# EAGLE design Main (EAGLE 9.6.2)
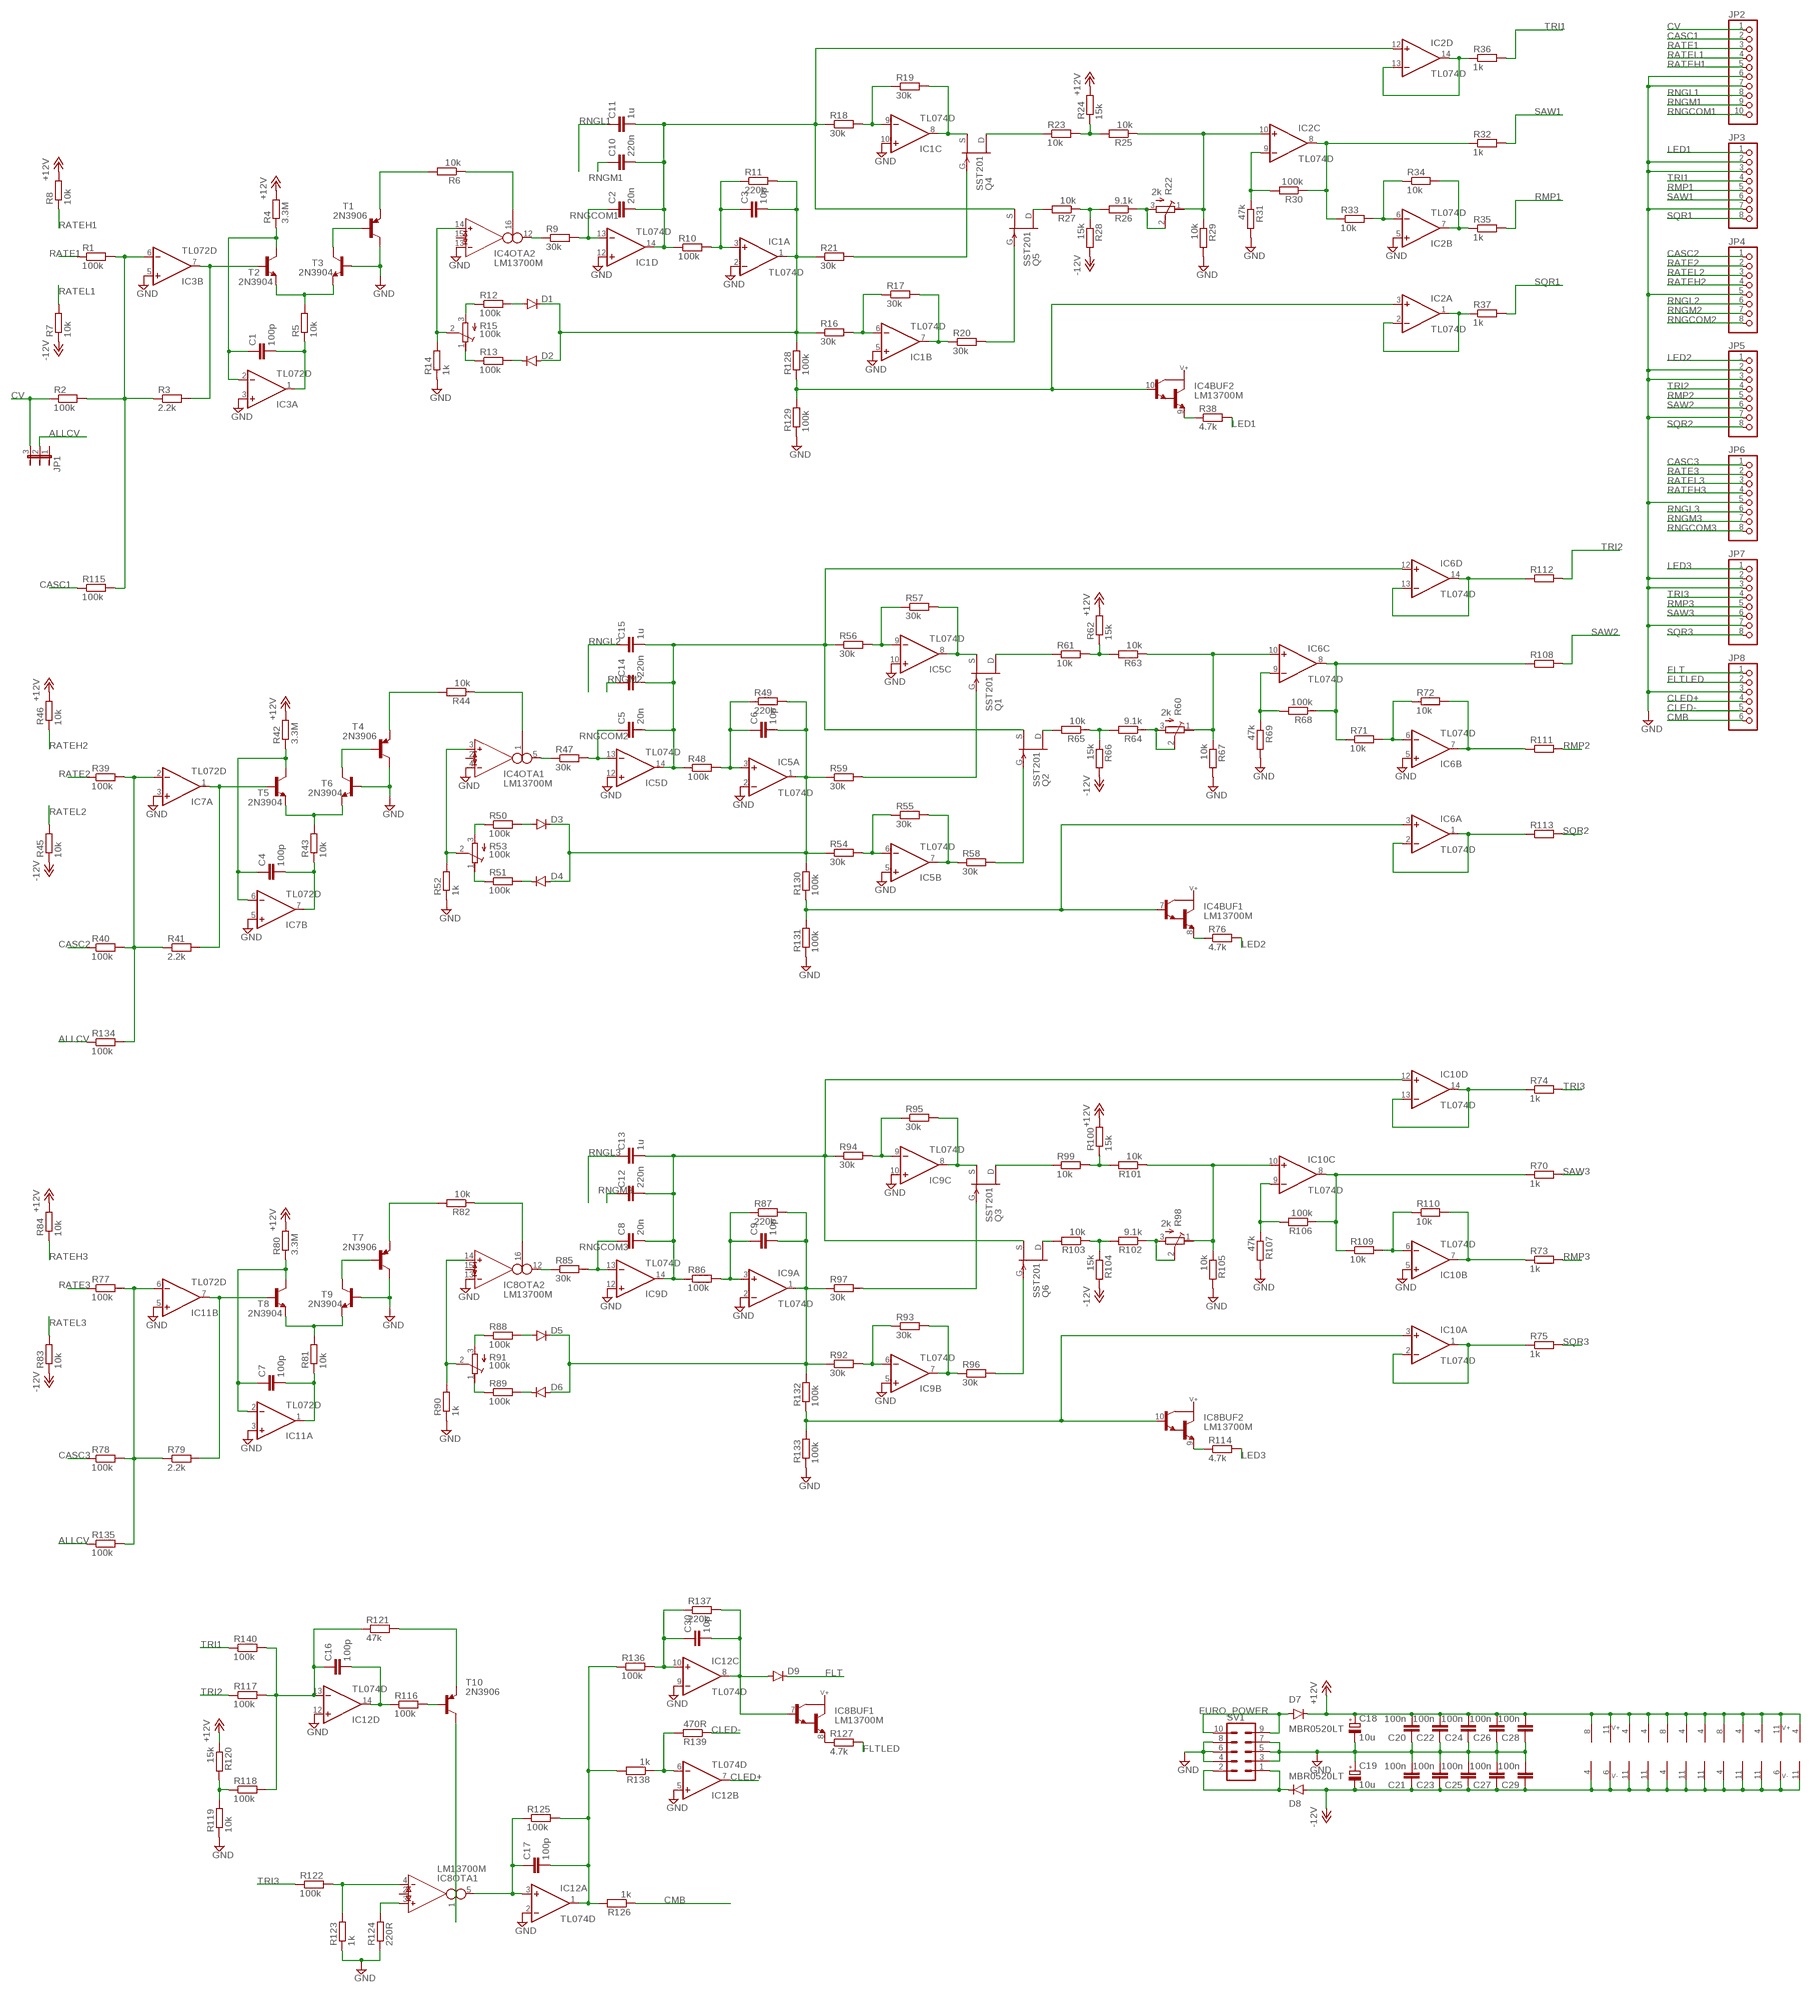
[diagram p0: schematic, sheet 1]

## Parts
C1  100p  C-EUC0805  [C0805]
C2  20n  C-EU050-025X075  [C050-025X075]
C3  10p  C-EUC0805  [C0805]
C4  100p  C-EUC0805  [C0805]
C5  20n  C-EU050-025X075  [C050-025X075]
C6  10p  C-EUC0805  [C0805]
C7  100p  C-EUC0805  [C0805]
C8  20n  C-EU050-025X075  [C050-025X075]
C9  10p  C-EUC0805  [C0805]
C10  220n  C-EU050-035X075  [C050-035X075]
C11  1u  C-EU050-045X075  [C050-045X075]
C12  220n  C-EU050-035X075  [C050-035X075]
C13  1u  C-EU050-045X075  [C050-045X075]
C14  220n  C-EU050-035X075  [C050-035X075]
C15  1u  C-EU050-045X075  [C050-045X075]
C16  100p  C-EUC0805  [C0805]
C17  100p  C-EUC0805  [C0805]
C18  10u  CPOL-EUE2.5-5  [E2,5-5]
C19  10u  CPOL-EUE2.5-5  [E2,5-5]
C20  100n  C-EUC0805  [C0805]
C21  100n  C-EUC0805  [C0805]
C22  100n  C-EUC0805  [C0805]
C23  100n  C-EUC0805  [C0805]
C24  100n  C-EUC0805  [C0805]
C25  100n  C-EUC0805  [C0805]
C26  100n  C-EUC0805  [C0805]
C27  100n  C-EUC0805  [C0805]
C28  100n  C-EUC0805  [C0805]
C29  100n  C-EUC0805  [C0805]
C30  10p  C-EUC0805  [C0805]
D1  DIODE-SOD123  [SOD123]
D2  DIODE-SOD123  [SOD123]
D3  DIODE-SOD123  [SOD123]
D4  DIODE-SOD123  [SOD123]
D5  DIODE-SOD123  [SOD123]
D6  DIODE-SOD123  [SOD123]
D7  MBR0520LT  [SOD123]
D8  MBR0520LT  [SOD123]
D9  DIODE-SOD123  [SOD123]
IC1  TL074D  [SO14]
IC2  TL074D  [SO14]
IC3  TL072D  [SO08]
IC4  LM13700M  [SO16]
IC5  TL074D  [SO14]
IC6  TL074D  [SO14]
IC7  TL072D  [SO08]
IC8  LM13700M  [SO16]
IC9  TL074D  [SO14]
IC10  TL074D  [SO14]
IC11  TL072D  [SO08]
IC12  TL074D  [SO14]
JP1  JP2E  [JP2]
JP2  PINHD-1X10  [1X10]
JP3  PINHD-1X8  [1X08]
JP4  PINHD-1X8  [1X08]
JP5  PINHD-1X8  [1X08]
JP6  PINHD-1X8  [1X08]
JP7  PINHD-1X8  [1X08]
JP8  PINHD-1X6  [1X06]
Q1  SST201  [SOT23]
Q2  SST201  [SOT23]
Q3  SST201  [SOT23]
Q4  SST201  [SOT23]
Q5  SST201  [SOT23]
Q6  SST201  [SOT23]
R1  100k  R-EU_R0805  [R0805]
R2  100k  R-EU_R0805  [R0805]
R3  2.2k  R-EU_R0805  [R0805]
R4  3.3M  R-EU_R0805  [R0805]
R5  10k  R-EU_R0805  [R0805]
R6  10k  R-EU_R0805  [R0805]
R7  10k  R-EU_R0805  [R0805]
R8  10k  R-EU_R0805  [R0805]
R9  30k  R-EU_R0805  [R0805]
R10  100k  R-EU_R0805  [R0805]
R11  220k  R-EU_R0805  [R0805]
R12  100k  R-EU_R0805  [R0805]
R13  100k  R-EU_R0805  [R0805]
R14  1k  R-EU_R0805  [R0805]
R15  100k  R-TRIMMT93XB  [RTRIMT93XB]
R16  30k  R-EU_R0805  [R0805]
R17  30k  R-EU_R0805  [R0805]
R18  30k  R-EU_R0805  [R0805]
R19  30k  R-EU_R0805  [R0805]
R20  30k  R-EU_R0805  [R0805]
R21  30k  R-EU_R0805  [R0805]
R22  2k  R-TRIMMT93XB  [RTRIMT93XB]
R23  10k  R-EU_R0805  [R0805]
R24  15k  R-EU_R0805  [R0805]
R25  10k  R-EU_R0805  [R0805]
R26  9.1k  R-EU_R0805  [R0805]
R27  10k  R-EU_R0805  [R0805]
R28  15k  R-EU_R0805  [R0805]
R29  10k  R-EU_R0805  [R0805]
R30  100k  R-EU_R0805  [R0805]
R31  47k  R-EU_R0805  [R0805]
R32  1k  R-EU_R0805  [R0805]
R33  10k  R-EU_R0805  [R0805]
R34  10k  R-EU_R0805  [R0805]
R35  1k  R-EU_R0805  [R0805]
R36  1k  R-EU_R0805  [R0805]
R37  1k  R-EU_R0805  [R0805]
R38  4.7k  R-EU_R0805  [R0805]
R39  100k  R-EU_R0805  [R0805]
R40  100k  R-EU_R0805  [R0805]
R41  2.2k  R-EU_R0805  [R0805]
R42  3.3M  R-EU_R0805  [R0805]
R43  10k  R-EU_R0805  [R0805]
R44  10k  R-EU_R0805  [R0805]
R45  10k  R-EU_R0805  [R0805]
R46  10k  R-EU_R0805  [R0805]
R47  30k  R-EU_R0805  [R0805]
R48  100k  R-EU_R0805  [R0805]
R49  220k  R-EU_R0805  [R0805]
R50  100k  R-EU_R0805  [R0805]
R51  100k  R-EU_R0805  [R0805]
R52  1k  R-EU_R0805  [R0805]
R53  100k  R-TRIMMT93XB  [RTRIMT93XB]
R54  30k  R-EU_R0805  [R0805]
R55  30k  R-EU_R0805  [R0805]
R56  30k  R-EU_R0805  [R0805]
R57  30k  R-EU_R0805  [R0805]
R58  30k  R-EU_R0805  [R0805]
R59  30k  R-EU_R0805  [R0805]
R60  2k  R-TRIMMT93XB  [RTRIMT93XB]
R61  10k  R-EU_R0805  [R0805]
R62  15k  R-EU_R0805  [R0805]
R63  10k  R-EU_R0805  [R0805]
R64  9.1k  R-EU_R0805  [R0805]
R65  10k  R-EU_R0805  [R0805]
R66  15k  R-EU_R0805  [R0805]
R67  10k  R-EU_R0805  [R0805]
R68  100k  R-EU_R0805  [R0805]
R69  47k  R-EU_R0805  [R0805]
R70  1k  R-EU_R0805  [R0805]
R71  10k  R-EU_R0805  [R0805]
R72  10k  R-EU_R0805  [R0805]
R73  1k  R-EU_R0805  [R0805]
R74  1k  R-EU_R0805  [R0805]
R75  1k  R-EU_R0805  [R0805]
R76  4.7k  R-EU_R0805  [R0805]
R77  100k  R-EU_R0805  [R0805]
R78  100k  R-EU_R0805  [R0805]
R79  2.2k  R-EU_R0805  [R0805]
R80  3.3M  R-EU_R0805  [R0805]
R81  10k  R-EU_R0805  [R0805]
R82  10k  R-EU_R0805  [R0805]
R83  10k  R-EU_R0805  [R0805]
R84  10k  R-EU_R0805  [R0805]
R85  30k  R-EU_R0805  [R0805]
R86  100k  R-EU_R0805  [R0805]
R87  220k  R-EU_R0805  [R0805]
R88  100k  R-EU_R0805  [R0805]
R89  100k  R-EU_R0805  [R0805]
R90  1k  R-EU_R0805  [R0805]
R91  100k  R-TRIMMT93XB  [RTRIMT93XB]
R92  30k  R-EU_R0805  [R0805]
R93  30k  R-EU_R0805  [R0805]
R94  30k  R-EU_R0805  [R0805]
R95  30k  R-EU_R0805  [R0805]
R96  30k  R-EU_R0805  [R0805]
R97  30k  R-EU_R0805  [R0805]
R98  2k  R-TRIMMT93XB  [RTRIMT93XB]
R99  10k  R-EU_R0805  [R0805]
R100  15k  R-EU_R0805  [R0805]
R101  10k  R-EU_R0805  [R0805]
R102  9.1k  R-EU_R0805  [R0805]
R103  10k  R-EU_R0805  [R0805]
R104  15k  R-EU_R0805  [R0805]
R105  10k  R-EU_R0805  [R0805]
R106  100k  R-EU_R0805  [R0805]
R107  47k  R-EU_R0805  [R0805]
R108  R-EU_R0805  [R0805]
R109  10k  R-EU_R0805  [R0805]
R110  10k  R-EU_R0805  [R0805]
R111  R-EU_R0805  [R0805]
R112  R-EU_R0805  [R0805]
R113  R-EU_R0805  [R0805]
R114  4.7k  R-EU_R0805  [R0805]
R115  100k  R-EU_R0805  [R0805]
R116  100k  R-EU_R0805  [R0805]
R117  100k  R-EU_R0805  [R0805]
R118  100k  R-EU_R0805  [R0805]
R119  10k  R-EU_R0805  [R0805]
R120  15k  R-EU_R0805  [R0805]
R121  47k  R-EU_R0805  [R0805]
R122  100k  R-EU_R0805  [R0805]
R123  1k  R-EU_R0805  [R0805]
R124  220R  R-EU_R0805  [R0805]
R125  100k  R-EU_R0805  [R0805]
R126  1k  R-EU_R0805  [R0805]
R127  4.7k  R-EU_R0805  [R0805]
R128  100k  R-EU_R0805  [R0805]
R129  100k  R-EU_R0805  [R0805]
R130  100k  R-EU_R0805  [R0805]
R131  100k  R-EU_R0805  [R0805]
R132  100k  R-EU_R0805  [R0805]
R133  100k  R-EU_R0805  [R0805]
R134  100k  R-EU_R0805  [R0805]
R135  100k  R-EU_R0805  [R0805]
R136  100k  R-EU_R0805  [R0805]
R137  220k  R-EU_R0805  [R0805]
R138  1k  R-EU_R0805  [R0805]
R139  470R  R-EU_R0805  [R0805]
R140  100k  R-EU_R0805  [R0805]
SV1  EURO_POWER  EURO_POWER_HEADERFAT_PADS  [EURO_PWR_HEADER_FAT]
T1  2N3906  MMBT3906LT1-PNP-SOT23-BEC  [SOT23-BEC]
T2  2N3904  MMBT3904LT1-NPN-SOT23-BEC  [SOT23-BEC]
T3  2N3904  MMBT3904LT1-NPN-SOT23-BEC  [SOT23-BEC]
T4  2N3906  MMBT3906LT1-PNP-SOT23-BEC  [SOT23-BEC]
T5  2N3904  MMBT3904LT1-NPN-SOT23-BEC  [SOT23-BEC]
T6  2N3904  MMBT3904LT1-NPN-SOT23-BEC  [SOT23-BEC]
T7  2N3906  MMBT3906LT1-PNP-SOT23-BEC  [SOT23-BEC]
T8  2N3904  MMBT3904LT1-NPN-SOT23-BEC  [SOT23-BEC]
T9  2N3904  MMBT3904LT1-NPN-SOT23-BEC  [SOT23-BEC]
T10  2N3906  MMBT3906LT1-PNP-SOT23-BEC  [SOT23-BEC]

## Nets
+12V: C18.+ C20.2 C22.2 C24.2 C26.2 C28.2 D7.C IC1.4(P:V+) IC2.4(P:V+) IC3.8(P:V+) IC4.11(SUPPLY:V+) IC5.4(P:V+) IC6.4(P:V+) IC7.8(P:V+) IC8.11(SUPPLY:V+) IC9.4(P:V+) IC10.4(P:V+) IC11.8(P:V+) IC12.4(P:V+) R4.2 R8.2 R24.2 R42.2 R46.2 R62.2 R80.2 R84.2 R100.2 R120.1
-12V: C19.- C21.1 C23.1 C25.1 C27.1 C29.1 D8.A IC1.11(P:V-) IC2.11(P:V-) IC3.4(P:V-) IC4.6(SUPPLY:V-) IC5.11(P:V-) IC6.11(P:V-) IC7.4(P:V-) IC8.6(SUPPLY:V-) IC9.11(P:V-) IC10.11(P:V-) IC11.4(P:V-) IC12.11(P:V-) R7.1 R28.2 R45.1 R66.2 R83.1 R104.2
ALLCV: JP1.2 R134.1 R135.1
CASC1: JP2.2 R115.1
CASC2: JP4.1 R40.1
CASC3: JP6.1 R78.1
CLED+: IC12.7(B:OUT) JP8.4
CLED-: JP8.5 R139.1
CMB: JP8.6 R126.1
CV: JP1.3 JP2.1 R2.1
FLT: D9.C JP8.1
FLTLED: JP8.2 R127.2
GND: C18.- C19.+ C20.1 C21.2 C22.1 C23.2 C24.1 C25.2 C26.1 C27.2 C28.1 C29.2 IC1.2(A:-IN) IC1.5(B:+IN) IC1.10(C:+IN) IC1.12(D:+IN) IC2.5(B:+IN) IC3.3(A:+IN) IC3.5(B:+IN) IC4.4(OTA1:IN_N) IC4.13(OTA2:IN_N) IC5.2(A:-IN) IC5.5(B:+IN) IC5.10(C:+IN) IC5.12(D:+IN) IC6.5(B:+IN) IC7.3(A:+IN) IC7.5(B:+IN) IC8.13(OTA2:IN_N) IC9.2(A:-IN) IC9.5(B:+IN) IC9.10(C:+IN) IC9.12(D:+IN) IC10.5(B:+IN) IC11.3(A:+IN) IC11.5(B:+IN) IC12.2(A:-IN) IC12.5(B:+IN) IC12.9(C:-IN) IC12.12(D:+IN) JP2.6 JP2.7 JP3.2 JP3.3 JP3.7 JP4.5 JP5.2 JP5.3 JP5.7 JP6.5 JP7.2 JP7.3 JP7.7 JP8.3 R14.1 R29.2 R31.2 R52.1 R67.2 R69.2 R90.1 R105.2 R107.2 R119.1 R123.1 R124.1 R129.1 R131.1 R133.1 SV1.3 SV1.4 SV1.5 SV1.6 SV1.7 SV1.8 T1.C T3.B T4.C T6.B T7.C T9.B
LED1: JP3.1 R38.2
LED2: JP5.1 R76.2
LED3: JP7.1 R114.2
N$1: IC8.8(BUF1:E) R127.1
N$2: C30.1 IC12.10(C:+IN) R136.2 R137.1
N$3: C30.2 D9.A IC8.7(BUF1:B) IC12.8(C:OUT) R137.2
N$4: IC3.6(B:-IN) R1.2 R2.2 R3.1 R115.2
N$5: R5.2 T2.E T3.E
N$6: IC3.7(B:OUT) R3.2 T2.B
N$7: C1.1 IC3.2(A:-IN) R4.1 T2.C
N$8: C1.2 IC3.1(A:OUT) R5.1
N$9: T1.B T3.C
N$10: D2.C R13.2
N$11: R6.2 T1.E
N$12: IC12.6(B:-IN) R138.1 R139.2
N$13: C16.1 IC12.13(D:-IN) R117.2 R118.2 R121.1 R140.2
N$14: D1.A R12.2
N$15: IC4.12(OTA2:OUT) R9.1
N$17: C2.2 C10.2 C11.2 IC1.14(D:OUT) IC2.12(D:+IN) Q5.2(S) R10.1 R18.1
N$18: C3.1 IC1.3(A:+IN) R10.2 R11.1
N$19: IC2.3(A:+IN) IC4.10(BUF2:B) R128.1 R129.2
N$20: R12.1 R15.3(A)
N$21: R13.1 R15.1(E)
N$22: IC4.14(OTA2:IN_P) R14.2 R15.2(S)
N$23: IC1.6(B:-IN) R16.2 R17.1
N$24: IC1.7(B:OUT) R17.2 R20.1
N$25: IC1.9(C:-IN) R18.2 R19.1
N$26: IC1.8(C:OUT) Q4.2(S) R19.2
N$27: Q4.3(G) R21.2
N$28: Q5.3(G) R20.2
N$29: Q4.1(D) R23.1
N$30: Q5.1(D) R27.2
N$31: R26.2 R27.1 R28.1
N$32: R23.2 R24.1 R25.2
N$33: IC2.10(C:+IN) R22.1(E) R25.1 R29.1
N$34: R22.2(S) R22.3(A) R26.1
N$36: IC7.2(A:-IN) R39.2 R40.2 R41.1 R134.2
N$37: IC2.9(C:-IN) R30.2 R31.1
N$38: IC2.8(C:OUT) R30.1 R32.1 R33.1
N$39: IC2.7(B:OUT) R34.2 R35.1
N$40: IC2.6(B:-IN) R33.2 R34.1
N$41: IC2.13(D:-IN) IC2.14(D:OUT) R36.1
N$42: IC2.1(A:OUT) IC2.2(A:-IN) R37.1
N$43: IC7.1(A:OUT) R41.2 T5.B
N$44: C4.1 IC7.6(B:-IN) R42.1 T5.C
N$45: IC4.9(BUF2:E) R38.1
N$47: IC4.16(OTA2:I_BIAS) R6.1
N$48: R43.2 T5.E T6.E
N$49: C4.2 IC7.7(B:OUT) R43.1
N$50: T4.B T6.C
N$53: D4.C R51.2
N$54: D3.A R50.2
N$55: IC4.5(OTA1:OUT) R47.1
N$57: C5.2 C14.2 C15.2 IC5.14(D:OUT) IC6.12(D:+IN) Q2.2(S) R48.1 R56.1
N$58: C6.1 IC5.3(A:+IN) R48.2 R49.1
N$59: IC4.7(BUF1:B) IC6.3(A:+IN) R130.1 R131.2
N$60: R50.1 R53.3(A)
N$61: R51.1 R53.1(E)
N$62: IC4.3(OTA1:IN_P) R52.2 R53.2(S)
N$63: IC5.6(B:-IN) R54.2 R55.1
N$64: IC5.7(B:OUT) R55.2 R58.1
N$65: IC5.9(C:-IN) R56.2 R57.1
N$66: IC5.8(C:OUT) Q1.2(S) R57.2
N$67: Q1.3(G) R59.2
N$68: Q2.3(G) R58.2
N$69: Q1.1(D) R61.1
N$70: Q2.1(D) R65.2
N$71: R64.2 R65.1 R66.1
N$72: R61.2 R62.1 R63.2
N$73: IC6.10(C:+IN) R60.1(E) R63.1 R67.1
N$74: R60.2(S) R60.3(A) R64.1
N$75: IC6.9(C:-IN) R68.2 R69.1
N$76: IC6.8(C:OUT) R68.1 R71.1 R108.1
N$77: IC6.7(B:OUT) R72.2 R111.1
N$78: IC6.6(B:-IN) R71.2 R72.1
N$79: IC6.13(D:-IN) IC6.14(D:OUT) R112.1
N$80: IC6.1(A:OUT) IC6.2(A:-IN) R113.1
N$82: R118.1 R119.2 R120.2
N$83: IC4.8(BUF1:E) R76.1
N$85: R44.2 T4.E
N$86: IC4.1(OTA1:I_BIAS) R44.1
N$91: IC11.6(B:-IN) R77.2 R78.2 R79.1 R135.2
N$92: IC11.7(B:OUT) R79.2 T8.B
N$93: C7.1 IC11.2(A:-IN) R80.1 T8.C
N$94: R81.2 T8.E T9.E
N$95: C7.2 IC11.1(A:OUT) R81.1
N$96: T7.B T9.C
N$99: D6.C R89.2
N$100: D5.A R88.2
N$101: IC8.12(OTA2:OUT) R85.1
N$103: C8.2 C12.2 C13.2 IC9.14(D:OUT) IC10.12(D:+IN) Q6.2(S) R86.1 R94.1
N$104: C9.1 IC9.3(A:+IN) R86.2 R87.1
N$105: IC8.10(BUF2:B) IC10.3(A:+IN) R132.1 R133.2
N$106: R88.1 R91.3(A)
N$107: R89.1 R91.1(E)
N$108: IC8.14(OTA2:IN_P) R90.2 R91.2(S)
N$109: IC9.6(B:-IN) R92.2 R93.1
N$110: IC9.7(B:OUT) R93.2 R96.1
N$111: IC9.9(C:-IN) R94.2 R95.1
N$112: IC9.8(C:OUT) Q3.2(S) R95.2
N$113: Q3.3(G) R97.2
N$114: Q6.3(G) R96.2
N$115: Q3.1(D) R99.1
N$116: Q6.1(D) R103.2
N$117: R102.2 R103.1 R104.1
N$118: R99.2 R100.1 R101.2
N$119: IC10.10(C:+IN) R98.1(E) R101.1 R105.1
N$120: R98.2(S) R98.3(A) R102.1
N$121: IC10.9(C:-IN) R106.2 R107.1
N$122: IC10.8(C:OUT) R70.1 R106.1 R109.1
N$123: IC10.7(B:OUT) R73.1 R110.2
N$124: IC10.6(B:-IN) R109.2 R110.1
N$125: IC10.13(D:-IN) IC10.14(D:OUT) R74.1
N$126: IC10.1(A:OUT) IC10.2(A:-IN) R75.1
N$127: IC8.9(BUF2:E) R114.1
N$129: R82.2 T7.E
N$130: IC8.16(OTA2:I_BIAS) R82.1
N$133: C16.2 IC12.14(D:OUT) R116.1
N$134: R116.2 T10.B
N$135: R121.2 T10.E
N$136: IC8.1(OTA1:I_BIAS) T10.C
N$137: IC8.3(OTA1:IN_P) R124.2
N$138: C17.2 IC12.1(A:OUT) R125.2 R126.2 R136.1 R138.2
N$139: IC8.4(OTA1:IN_N) R122.2 R123.2
N$142: C17.1 IC8.5(OTA1:OUT) IC12.3(A:+IN) R125.1
N$143: C9.2 D5.C D6.A IC9.1(A:OUT) R87.2 R92.1 R97.1 R132.2
N$144: C6.2 D3.C D4.A IC5.1(A:OUT) R49.2 R54.1 R59.1 R130.2
N$145: C3.2 D1.C D2.A IC1.1(A:OUT) R11.2 R16.1 R21.1 R128.2
N$146: D7.A SV1.9 SV1.10
N$147: D8.C SV1.1 SV1.2
RATE1: JP2.3 R1.1
RATE2: JP4.2 R39.1
RATE3: JP6.2 R77.1
RATEH1: JP2.5 R8.1
RATEH2: JP4.4 R46.1
RATEH3: JP6.4 R84.1
RATEL1: JP2.4 R7.2
RATEL2: JP4.3 R45.2
RATEL3: JP6.3 R83.2
RMP1: JP3.5 R35.2
RMP2: JP5.5 R111.2
RMP3: JP7.5 R73.2
RNGCOM1: C2.1 IC1.13(D:-IN) JP2.10 R9.2
RNGCOM2: C5.1 IC5.13(D:-IN) JP4.8 R47.2
RNGCOM3: C8.1 IC9.13(D:-IN) JP6.8 R85.2
RNGL1: C11.1 JP2.8
RNGL2: C15.1 JP4.6
RNGL3: C13.1 JP6.6
RNGM1: C10.1 JP2.9
RNGM2: C14.1 JP4.7
RNGM3: C12.1 JP6.7
SAW1: JP3.6 R32.2
SAW2: JP5.6 R108.2
SAW3: JP7.6 R70.2
SQR1: JP3.8 R37.2
SQR2: JP5.8 R113.2
SQR3: JP7.8 R75.2
TRI1: JP3.4 R36.2 R140.1
TRI2: JP5.4 R112.2 R117.1
TRI3: JP7.4 R74.2 R122.1
Unconnected: IC4.2(OTA1:I_DIODE) IC4.15(OTA2:I_DIODE) IC8.2(OTA1:I_DIODE) IC8.15(OTA2:I_DIODE) JP1.1

## Library data of the parts
C1-C17 C20-C30 = resistor:C-EU: CAPACITOR, European symbol
C18 C19 = resistor:CPOL-EU: POLARIZED CAPACITOR, European symbol
D1-D6 D9 = diode:DIODE-: DIODE
D7 D8 = diode:MBR0520LT: SCHOTTKY BARRIER RECTIFIER Source: http://onsemi.com .. MBR0520LT1-D.pdf
IC1 IC2 IC5 IC6 IC9 IC10 IC12 = linear:TL074: OP AMP
IC3 IC7 IC11 = linear:TL072: OP AMP
IC4 IC8 = ota:LM13700: Dual OTA with buffers
JP1 = jumper:JP2E: JUMPER
JP2 = pinhead:PINHD-1X10: PIN HEADER
JP3-JP7 = pinhead:PINHD-1X8: PIN HEADER
JP8 = pinhead:PINHD-1X6: PIN HEADER
Q1-Q6 = transistor-fet:?20*: TEMIC / Siliconix N-Channel JFET Source: JFET-J201_Siliconix_data.pdf
R1-R14 R16-R21 R23-R52 R54-R59 R61-R90 R92-R97 R99-R140 = resistor:R-EU_: RESISTOR, European symbol
R15 R22 R53 R60 R91 R98 = resistor:R-TRIMM: Trimm resistor
SV1 = MusicThingModular:EURO_POWER_HEADER: Power Header 10 pin power header for Eurorack Power Supplies Variants with fatter pads for easier soldering, and the LOCK variant which has 5mil offset pins to hold the component in place before soldering
T1 T4 T7 T10 = MusicThingModular:*-PNP-: PNP Transistror
T2 T3 T5 T6 T8 T9 = MusicThingModular:*-NPN-: NPN Transistror BF959 corrected 2008.03.06

## Board
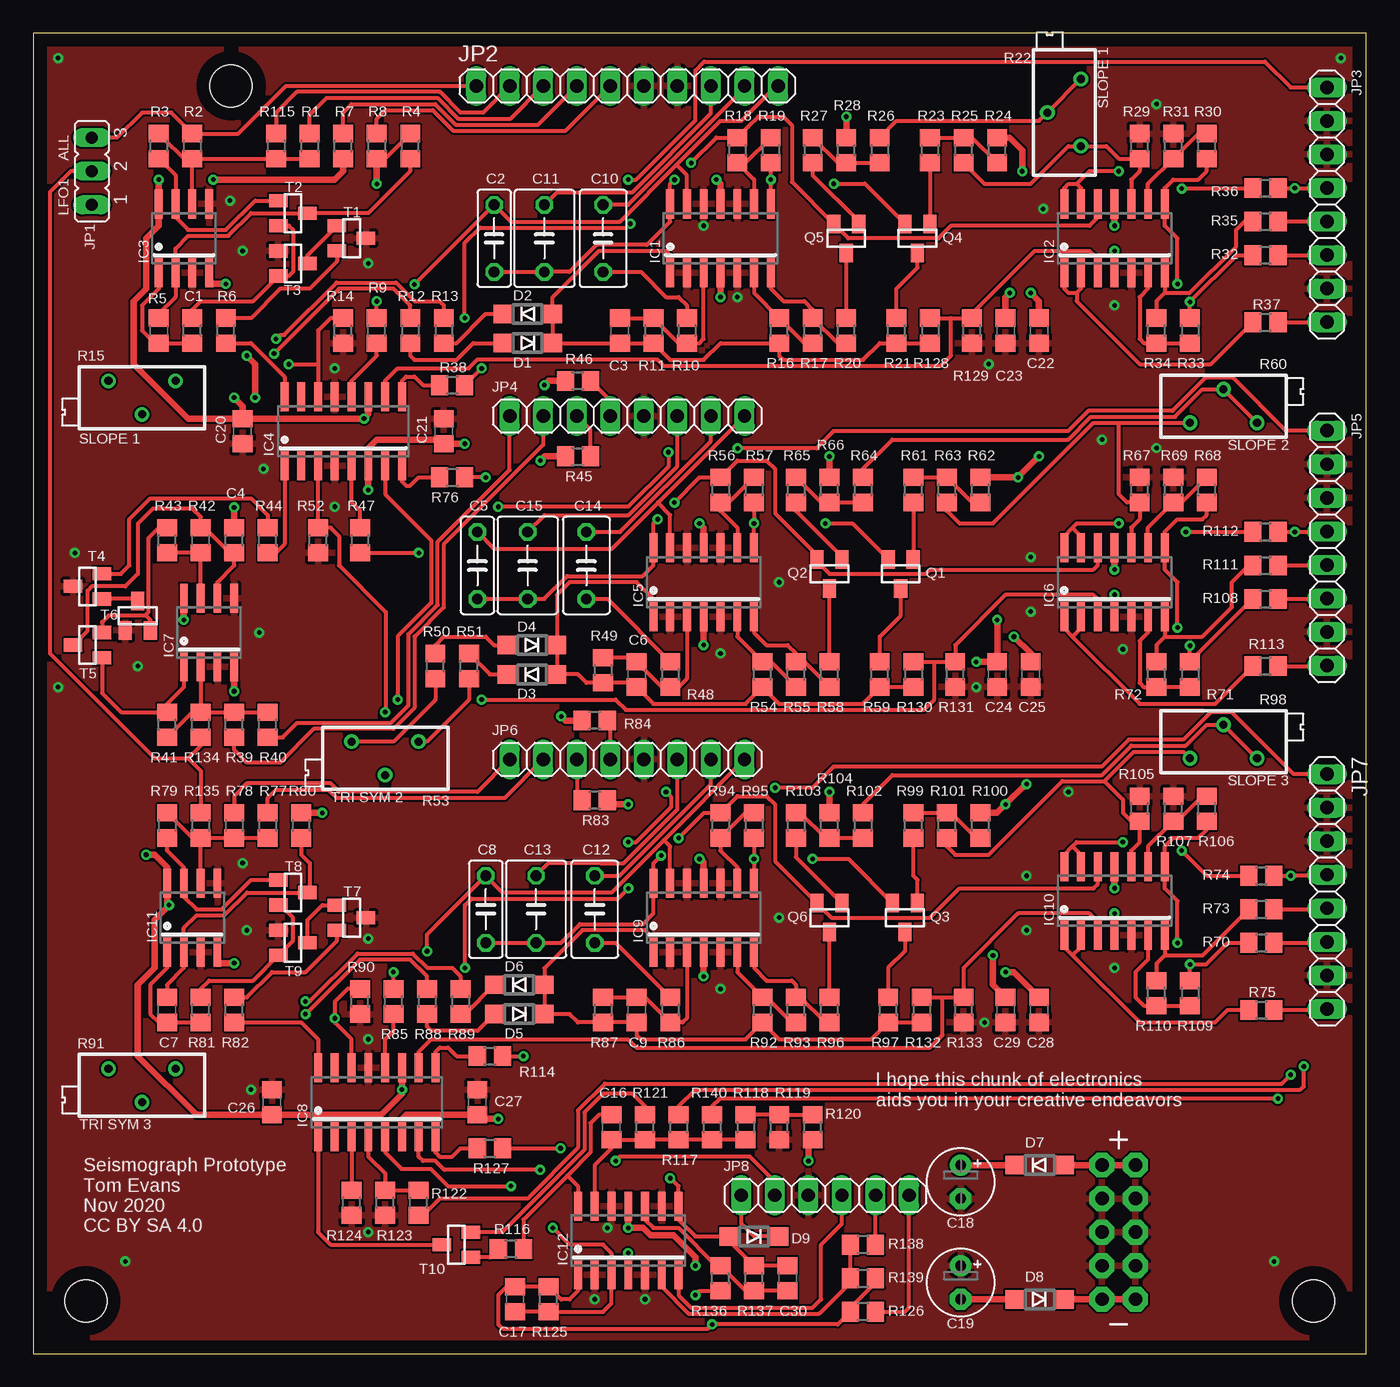
[diagram p1: board, top side]
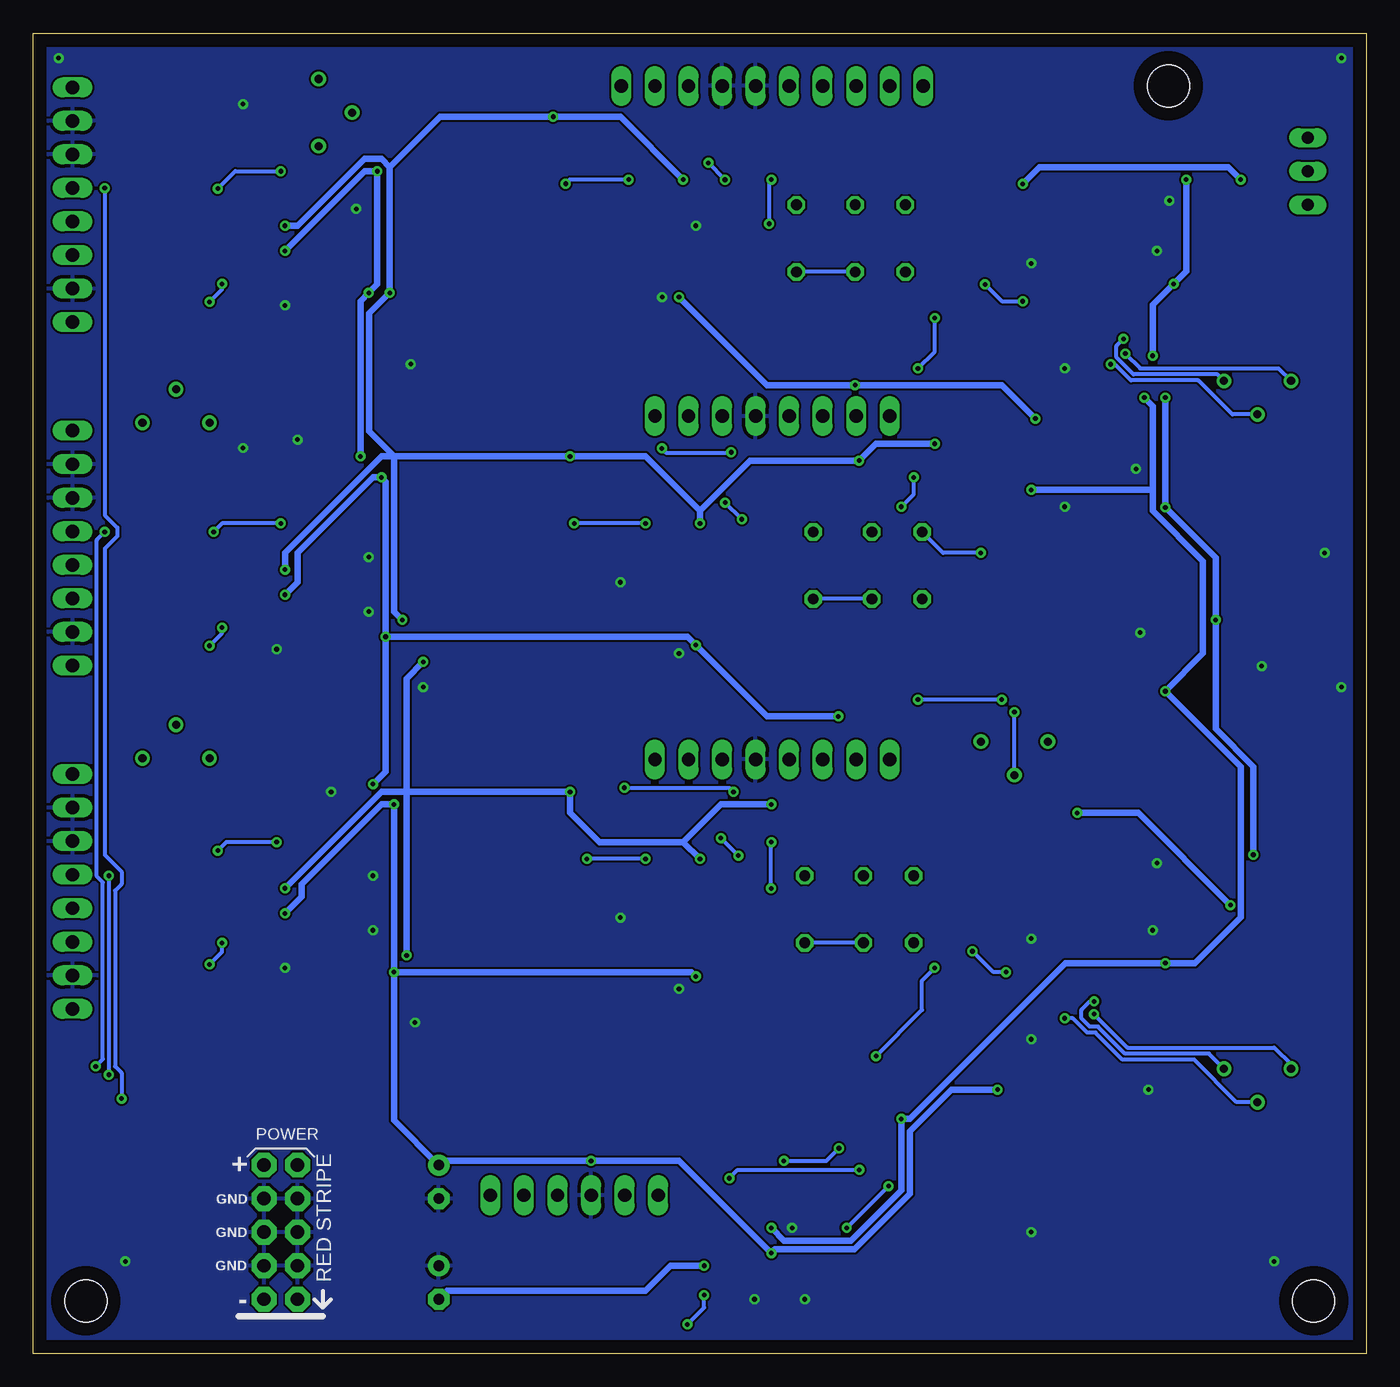
[diagram p2: board, bottom side, seen from below]

Size 101 x 100 mm. Coordinates in mm from the lower left corner, seen from the top.
Outline: 0,0 101,0 101,100 0,100 0,0
Copper layers (1*16): Top 0.035mm / dielectric 1.5mm / Bottom 0.035mm
Design rules "default": minimum track width 6mil, minimum drill 0.35mm, track to track 6mil, track to pad 6mil, pad to pad 6mil, via to via 6mil, smd to smd 6mil, copper to edge 40mil, drill to drill 6mil, minimum pad ring 10mil, minimum via ring 8mil, stop-mask expansion 4mil, vias tented up to drill 0mil, thermal gap 10mil
Holes 3.2 mm at 4,4 97,4 15,96

### Footprints (pad centres in the part's own frame; a part is rotated, then mirrored left to right if it is on the bottom)
C0805 = smd 1.3 x 1.5: 1 -0.95,0; 2 0.95,0
C050-025X075 = drill 0.813 octagon: 1 -2.54,0; 2 2.54,0
C050-035X075 = drill 0.813 octagon: 1 -2.54,0; 2 2.54,0
C050-045X075 = drill 0.813 octagon: 1 -2.54,0; 2 2.54,0
E2,5-5 = drill 0.813 pad 1.6: + -1.27,0 | drill 0.813 pad 1.6 octagon: - 1.27,0
SOD123 = smd 1.4 x 1.4: A 1.9,0; C -1.9,0
SO14 = smd 0.6 x 2.2: 1 -3.81,-2.6; 2 -2.54,-2.6; 3 -1.27,-2.6; 4 0,-2.6; 5 1.27,-2.6; 6 2.54,-2.6; 7 3.81,-2.6; 8 3.81,2.6; 9 2.54,2.6; 10 1.27,2.6; 11 0,2.6; 12 -1.27,2.6; 13 -2.54,2.6; 14 -3.81,2.6
SO08 = smd 0.6 x 2.2: 1 -1.905,-2.6; 2 -0.635,-2.6; 3 0.635,-2.6; 4 1.905,-2.6; 5 1.905,2.6; 6 0.635,2.6; 7 -0.635,2.6; 8 -1.905,2.6
SO16 = smd 0.6 x 2.2: 1 -4.445,-2.6; 2 -3.175,-2.6; 3 -1.905,-2.6; 4 -0.635,-2.6; 5 0.635,-2.6; 6 1.905,-2.6; 7 3.175,-2.6; 8 4.445,-2.6; 9 4.445,2.6; 10 3.175,2.6; 11 1.905,2.6; 12 0.635,2.6; 13 -0.635,2.6; 14 -1.905,2.6; 15 -3.175,2.6; 16 -4.445,2.6
JP2 = drill 0.914 long: 1 -2.54,0; 2 0,0; 3 2.54,0
1X10 = drill 1.016 long: 1 -11.43,0; 2 -8.89,0; 3 -6.35,0; 4 -3.81,0; 5 -1.27,0; 6 1.27,0; 7 3.81,0; 8 6.35,0; 9 8.89,0; 10 11.43,0
1X08 = drill 1.016 long: 1 -8.89,0; 2 -6.35,0; 3 -3.81,0; 4 -1.27,0; 5 1.27,0; 6 3.81,0; 7 6.35,0; 8 8.89,0
1X06 = drill 1.016 long: 1 -6.35,0; 2 -3.81,0; 3 -1.27,0; 4 1.27,0; 5 3.81,0; 6 6.35,0
SOT23 = smd 1 x 1.4: 1 -0.95,-1.1; 2 0.95,-1.1; 3 0,1.1
R0805 = smd 1.3 x 1.5: 1 -0.95,0; 2 0.95,0
RTRIMT93XB = drill 0.61: 1 1.27,-2.54; 2 -1.27,0; 3 1.27,2.54
EURO_PWR_HEADER_FAT = drill 1.016 pad 1.88 octagon: 1 -5.08,-1.27; 2 -5.08,1.27; 3 -2.54,-1.27; 4 -2.54,1.27; 5 0,-1.27; 6 0,1.27; 7 2.54,-1.27; 8 2.54,1.27; 9 5.08,-1.27; 10 5.08,1.27
SOT23-BEC = smd 1 x 1.4: B -0.95,-1.1; C 0,1.1; E 0.95,-1.1

### Placement (x,y rotation side)
C1  9.53,77.47 270 top
C2  34.92,84.45 270 top
C3  44.45,77.47 270 top
C4  12.7,61.59 270 top
C5  33.66,59.69 270 top
C6  45.72,51.44 270 top
C7  10.16,26.04 270 top
C8  34.29,33.66 270 top
C9  45.72,26.04 270 top
C10  43.18,84.45 270 top
C11  38.73,84.45 270 top
C12  42.55,33.66 270 top
C13  38.1,33.66 270 top
C14  41.91,59.69 270 top
C15  37.47,59.69 270 top
C16  43.81,17.14 90 top
C17  36.51,4.13 90 top
C18  70.26,13.02 270 top
C19  70.26,5.4 270 top
C20  15.88,69.85 90 top
C21  31.11,69.85 90 top
C22  76.2,77.47 90 top
C23  73.66,77.47 270 top
C24  75.56,51.44 90 top
C25  73.03,51.44 270 top
C26  18.1,19.05 270 top
C27  33.66,19.05 90 top
C28  76.2,26.04 90 top
C29  73.66,26.04 270 top
C30  57.15,5.71 90 top
D1  37.47,76.52 180 top
D2  37.47,78.74 0 top
D3  37.78,53.66 180 top
D4  37.78,51.44 0 top
D5  36.83,25.72 180 top
D6  36.83,27.94 0 top
D7  76.25,14.29 0 top
D8  76.25,4.13 180 top
D9  54.61,8.89 180 top
IC1  52.07,84.45 0 top
IC2  81.92,84.45 0 top
IC3  11.43,84.45 0 top
IC4  23.5,69.85 0 top
IC5  50.8,58.42 0 top
IC6  81.92,58.42 0 top
IC7  13.34,54.61 0 top
IC8  26.04,19.05 0 top
IC9  50.8,33.02 0 top
IC10  81.92,34.29 0 top
IC11  12.06,33.02 0 top
IC12  45.09,8.57 0 top
JP1  4.45,89.53 90 top
JP2  45,96 0 top
JP3  98,87 270 top
JP4  45,71 0 top
JP5  98,61 270 top
JP6  45,45 0 top
JP7  98,35 270 top
JP8  60,12 0 top
Q1  65.72,59.05 180 top
Q2  60.33,59.05 180 top
Q3  66.04,33.02 180 top
Q4  66.99,84.45 180 top
Q5  61.59,84.45 180 top
Q6  60.33,33.02 180 top
R1  20.95,91.44 270 top
R2  12.06,91.44 270 top
R3  9.53,91.44 270 top
R4  28.57,91.44 90 top
R5  12.06,77.47 90 top
R6  14.61,77.47 90 top
R7  23.5,91.44 90 top
R8  26.04,91.44 270 top
R9  26.04,77.47 90 top
R10  49.53,77.47 270 top
R11  46.99,77.47 270 top
R12  28.57,77.47 270 top
R13  31.11,77.47 270 top
R14  23.5,77.47 90 top
R15  8.26,72.39 90 top
R16  56.52,77.47 90 top
R17  59.05,77.47 90 top
R18  53.34,91.12 270 top
R19  55.88,91.12 270 top
R20  61.59,77.47 90 top
R21  65.41,77.47 90 top
R22  78.11,93.98 0 top
R23  67.94,91.12 90 top
R24  73.03,91.12 90 top
R25  70.48,91.12 90 top
R26  64.14,91.12 270 top
R27  59.05,91.12 270 top
R28  61.59,91.12 90 top
R29  83.82,91.44 90 top
R30  88.9,91.44 90 top
R31  86.36,91.44 90 top
R32  93.34,83.19 0 top
R33  87.63,77.47 270 top
R34  85.09,77.47 90 top
R35  93.34,85.72 0 top
R36  93.34,88.27 0 top
R37  93.34,78.11 0 top
R38  31.75,73.34 0 top
R39  15.24,47.62 90 top
R40  17.78,47.62 90 top
R41  10.16,47.62 90 top
R42  15.24,61.59 90 top
R43  10.16,61.59 90 top
R44  17.78,61.59 90 top
R45  41.27,67.94 0 top
R46  41.27,73.66 180 top
R47  24.77,61.59 270 top
R48  48.26,51.44 270 top
R49  43.18,51.75 270 top
R50  30.48,52.07 90 top
R51  33.02,52.07 90 top
R52  21.59,61.59 90 top
R53  26.67,45.09 90 top
R54  55.24,51.44 90 top
R55  57.78,51.44 90 top
R56  52.07,65.41 270 top
R57  54.61,65.41 270 top
R58  60.33,51.44 90 top
R59  64.14,51.44 90 top
R60  90.17,71.75 270 top
R61  66.67,65.41 90 top
R62  71.75,65.41 90 top
R63  69.22,65.41 90 top
R64  62.87,65.41 270 top
R65  57.78,65.41 270 top
R66  60.33,65.41 90 top
R67  83.82,65.41 90 top
R68  88.9,65.41 90 top
R69  86.36,65.41 90 top
R70  93.03,31.11 0 top
R71  87.63,51.44 270 top
R72  85.09,51.44 90 top
R73  93.03,33.66 0 top
R74  93.03,36.2 0 top
R75  93.03,26.04 0 top
R76  31.75,66.36 0 top
R77  17.78,40.01 270 top
R78  15.24,40.01 270 top
R79  10.16,40.01 270 top
R80  20.32,40.01 90 top
R81  12.7,26.04 90 top
R82  15.24,26.04 90 top
R83  42.55,41.91 180 top
R84  42.55,47.94 180 top
R85  27.3,26.67 90 top
R86  48.26,26.04 270 top
R87  43.18,26.04 270 top
R88  29.84,26.67 270 top
R89  32.38,26.67 270 top
R90  24.77,26.67 90 top
R91  8.26,20.32 90 top
R92  55.24,26.04 90 top
R93  57.78,26.04 90 top
R94  52.07,40.01 270 top
R95  54.61,40.01 270 top
R96  60.33,26.04 90 top
R97  64.77,26.04 90 top
R98  90.17,46.35 270 top
R99  66.67,40.01 90 top
R100  71.75,40.01 90 top
R101  69.22,40.01 90 top
R102  62.87,40.01 270 top
R103  57.78,40.01 270 top
R104  60.33,40.01 90 top
R105  83.82,41.27 90 top
R106  88.9,41.27 90 top
R107  86.36,41.27 90 top
R108  93.34,57.15 0 top
R109  87.63,27.3 270 top
R110  85.09,27.3 90 top
R111  93.34,59.69 0 top
R112  93.34,62.23 0 top
R113  93.34,52.07 0 top
R114  34.61,22.54 0 top
R115  18.41,91.44 270 top
R116  36.2,7.94 180 top
R117  48.9,17.14 270 top
R118  53.98,17.14 270 top
R119  56.52,17.14 90 top
R120  59.05,17.14 90 top
R121  46.35,17.14 90 top
R122  29.21,11.43 90 top
R123  26.67,11.43 90 top
R124  24.13,11.43 90 top
R125  39.05,4.13 90 top
R126  62.87,3.17 180 top
R127  34.61,15.56 0 top
R128  67.94,77.47 270 top
R129  71.12,77.47 90 top
R130  66.67,51.44 270 top
R131  69.85,51.44 90 top
R132  67.31,26.04 270 top
R133  70.48,26.04 90 top
R134  12.7,47.62 90 top
R135  12.7,40.01 270 top
R136  52.07,5.71 90 top
R137  54.61,5.71 90 top
R138  62.87,5.71 0 top
R139  62.87,8.26 180 top
R140  51.44,17.14 270 top
SV1  82.23,9.21 90 bottom
T1  24.13,84.45 270 top
T2  19.68,86.36 270 top
T3  19.68,82.55 270 top
T4  4.13,58.1 90 top
T5  4.13,53.66 90 top
T6  7.94,55.88 0 top
T7  24.13,33.02 270 top
T8  19.68,34.92 270 top
T9  19.68,31.11 270 top
T10  32.07,8.26 90 top

### Tracks (layer width: path | path; a pad name or v marks a point on that pad's centre or on a via)
+12V  (via drill 0.35)
  Top 0.305: R8.2 26.68,90.49 R4.2
  Top 0.508: D7.C C18.+ | IC10.4 v81.92,33.34 | R100.2 73.02,40.95 v73.66,41.59 75.2,43.13 v75.25,43.13 | C28.2 74.3,28.89 v73.66,28.89 | v50.8,28.57 IC9.4 | IC8.11 v27.94,20 27.94,19.68 26.36,18.1 C26.2 12.38,18.1 7.94,22.54 7.94,27.94 9.21,29.21 9.21,32.87 v10.31,33.97 10.16,34.12 IC11.8 10.16,36.83 9.21,37.78 v8.57,37.78 | v11.43,55.56 IC7.8 | v15.24,64.09 R42.2 | v15.24,72.39 15.88,71.75 C20.2 | C20.2 11.75,70.8 7.62,74.93 7.62,79.69 8.57,80.64 8.57,84.45 9.53,85.41 IC3.8 v9.53,88.9 | v26.04,88.58 R8.2 | IC4.11 25.4,71.12 v25.08,70.8 C20.2 | v38.73,73.34 39.05,73.66 R46.2 | R84.2 40.32,47.94 v40.01,48.26 | v50.8,53.66 IC5.4 | v74.3,54.29 75.56,53.02 C24.2 | R62.2 v74.61,66.36 v76.2,67.94 | IC6.4 v81.92,57.47 | v75.56,80.33 76.2,79.69 C22.2 | R24.2 73.98,92.07 74.93,91.12 v74.93,89.53 | v81.92,83.5 IC2.4 | v52.07,80.01 IC1.4 | v21.91,40.96 v21.91,40.95 R80.2 | v45.09,7.62 IC12.4 | v58.74,14.61 58.74,15.88 R120.1
  Bottom 0.508: v81.92,33.34 80.64,34.61 80.64,35.56 74.61,41.59 v73.66,41.59 v73.66,28.89 | v73.66,28.89 51.12,28.89 v50.8,28.57 | v27.94,20 31.43,20 34.58,16.85 34.58,12.11 38.78,7.91 44.79,7.91 v45.09,7.62 52.07,14.61 v58.74,14.61 69.94,14.61 C18.+ 73.66,17.68 v73.66,28.89 | v8.57,37.78 8.57,44.45 11.43,47.31 v11.43,55.56 11.43,60.28 v15.24,64.09 v15.24,72.39 | v9.53,88.9 10.48,89.85 24.77,89.85 v26.04,88.58 | v25.08,70.8 27.62,73.34 v38.73,73.34 45.4,73.34 v52.07,80.01 | v40.01,48.26 45.4,48.26 v50.8,53.66 51.44,54.29 v74.3,54.29 | v74.3,54.29 74.3,66.04 v74.61,66.36 75.25,66.36 80.96,60.64 80.96,58.42 v81.92,57.47 | v76.2,67.94 76.2,79.69 v75.56,80.33 74.93,80.96 v74.93,89.53 75.88,89.53 v81.92,83.5 | v74.3,54.29 74.3,44.08 v75.25,43.13 | v10.31,33.97 17.3,40.96 v21.91,40.96
-12V  (via drill 0.35)
  Top 0.508: C19.- D8.A | IC10.11 v81.92,35.24 | v60.33,42.55 R104.2 | v72.71,30.16 72.71,27.94 C29.1 | IC9.11 50.8,37.21 50.54,37.47 v50.48,37.47 | v45.09,41.59 43.81,41.59 R83.1 | v35.24,17.78 33.98,17.78 C27.1 28.26,18.1 27.94,17.78 IC8.6 | v15.24,29.58 14.18,29.58 13.97,29.79 IC11.4 | v15.24,50.16 IC7.4 | v25.4,65.41 IC4.6 25.4,68.58 26.04,69.22 30.8,69.22 C21.1 v32.7,68.9 | R45.1 38.75,67.94 v38.42,67.62 | v14.61,81.01 13.54,81.01 13.34,81.22 IC3.4 | v16.19,75.56 16.83,74.93 v16.83,72.39 | R7.1 23.5,89.53 22.86,88.9 v13.65,88.9 | v73.03,55.56 C25.1 v71.44,52.38 v71.44,52.39 | v60.33,67.94 R66.2 | v50.48,62.87 50.8,62.55 IC5.11 | v81.92,59.37 IC6.11 | v73.98,80.33 73.66,80.01 C23.1 | v61.59,93.66 R28.2 | v81.92,85.41 IC2.11 | v51.75,88.9 52.07,88.58 IC1.11 | IC12.11 v45.09,9.53 46.2,9.53 46.76,8.97 48.5,8.97 50.16,7.3 v50.16,6.67
  Bottom 0.508: v81.92,35.24 74.61,42.55 72.71,42.55 | 72.71,42.55 v60.33,42.55 R104.2 58.1,38.73 51.75,38.73 | v72.71,30.16 72.71,42.55 | v50.48,37.47 51.75,38.73 | 51.75,38.73 48.9,41.59 v45.09,41.59 | v25.4,65.41 16.19,65.41 | v32.7,68.9 37.15,68.9 v38.42,67.62 46.68,67.62 50.48,63.82 | v16.83,72.39 16.19,71.75 16.19,65.41 | v16.19,75.56 16.19,79.42 v14.61,81.01 13.65,81.96 v13.65,88.9 | 16.19,65.41 16.19,63.82 12.38,60.01 12.38,53.02 v15.24,50.16 9.53,44.45 9.53,33.07 13.02,29.58 v15.24,29.58 22.79,29.58 34.59,17.78 v35.24,17.78 35.24,12.38 39.05,8.57 44.13,8.57 v45.09,9.53 | v73.03,55.56 73.64,56.17 73.64,67.94 | 73.64,67.94 v60.33,67.94 54.61,67.94 50.48,63.82 | 73.64,67.94 74.61,67.94 81.92,60.64 v81.92,59.37 | 73.64,67.94 75.54,69.85 75.54,78.77 v73.98,80.33 73.98,89.85 | 73.98,89.85 74.61,90.49 75.88,90.49 80.96,85.41 v81.92,85.41 | 73.98,89.85 70.17,93.66 v61.59,93.66 56.52,93.66 v51.75,88.9 | v71.44,52.39 72.71,51.12 72.71,42.55 | v50.48,62.87 50.48,63.82 | C19.- 69.63,4.76 54.61,4.76 52.7,6.67 v50.16,6.67
ALLCV
  Top 0.305: JP1.2 2.86,89.53 1.27,87.95 1.27,53.02 9.21,45.09 11.75,45.09 | R134.1 12.7,46.04 11.75,45.09 | 11.75,45.09 12.7,44.13 R135.1
CASC1
  Top 0.305: JP2.2 34.09,93.98 32.38,93.98 30.82,95.54 19.98,95.54 18.41,93.98 R115.1
CASC2
  Top 0.305: R40.1 18.91,46.67 20,47.77 27.12,47.77 28.43,49.08 28.43,54.48 30.66,56.7 30.66,61.47 36.11,66.92 JP4.1
CASC3
  Top 0.305: JP6.1 33.66,42.55 23.18,42.55 22.54,43.18 16.19,43.18 15.24,42.23 R78.1
CLED+
  Top 0.305: IC12.7 48.9,4.45 49.85,3.49 59.05,3.49 59.69,4.13 59.69,8.26 61.27,9.84 JP8.4
CLED-
  Top 0.305: R139.1 63.81,12.27 JP8.5
CMB
  Top 0.305: R126.1 66.04,3.17 66.35,3.48 JP8.6
CV
  Top 0.305: JP1.3 6.35,92.08 8.26,93.98 10.47,93.98 R2.1 15.55,92.39 19.16,96 JP2.1
FLT
  Top 0.305: D9.C 54.61,8.89 53.65,9.85 JP8.1
FLTLED  (via drill 0.35)
  Top 0.305: R127.2 v39.96,15.56 | v44.13,14.61 44.45,14.92 54.29,14.92 56.19,13.03 JP8.2
  Bottom 0.305: v39.96,15.56 40.91,14.61 v44.13,14.61
GND  (via drill 0.35)
  other vias: 16.19,32.07 17.46,66.99 22.86,64.14 22.86,74.61 15.88,83.5 14.92,87.31 50.8,85.41 53.34,80.01 25.4,23.81 16.51,20 56.52,58.42 52.07,53.02 82.55,53.34 56.52,33.02 25.4,31.43 52.07,27.62 46.35,4.13 42.55,4.13 7,7 1.91,98.11 99.06,98.11 94,7 72.07,25.08 71.44,50.48 72.39,74.93 15.88,37.15 17.14,54.61 7.94,52.07 25.4,82.55 81.92,79.38 85.09,94.61 85.09,68.58 81.92,29.21 25.4,9.21 1.91,50.48 3.17,60.64 75.25,32.07 75.25,36.2 75.56,56.2 75.56,60.33 78.42,42.55 80.96,69.22 76.52,86.68 43.5,9.53
  pour Bottom: 0,100.01 100.97,100.01 100.97,0 0,0
  pour Top: 0,100.01 100.97,100.01 100.97,0 0,0
LED1  (via drill 0.35)
  Top 0.305: R38.2 v33.97,74.61 | v32.7,78.42 32.7,84.13 33.84,85.27 44.96,85.27 v45.25,85.56 | v45.09,88.9 45.69,88.9 50.16,93.38 50.16,97.16 50.84,97.83 93.31,97.83 95.25,95.89 JP3.1
  Bottom 0.305: v33.97,74.61 32.7,75.88 v32.7,78.42 | v45.09,88.9 45.25,88.73 v45.25,85.56
LED2  (via drill 0.35)
  Top 0.305: JP5.1 94.89,69.89 90.89,73.89 88.8,73.89 86.31,71.4 79.95,71.4 78.4,69.85 60.64,69.85 59.35,68.56 v53.36,68.56 | v48.13,68.26 48.13,67.18 45.09,64.14 v35.24,64.14 | v34.29,66.36 R76.2
  Bottom 0.305: v53.36,68.56 53.05,68.24 48.15,68.24 v48.13,68.26 | v35.24,64.14 34.29,65.09 v34.29,66.36
LED3  (via drill 0.35)
  Top 0.305: JP7.1 95.49,43.89 90.81,48.58 89.21,48.58 87.12,46.49 83,46.49 80.95,44.45 60.64,44.45 59.05,42.86 v56.2,42.86 | v47.94,42.55 48.35,42.13 48.35,41.4 45.69,38.73 v45.09,38.73 | R114.2 v37.15,22.54 | v32.71,29.22 32.71,33.97 33.21,34.47 44.32,34.47 v45.09,35.24
  Bottom 0.305: v56.2,42.86 48.25,42.86 v47.94,42.55 | v37.15,22.54 33.66,26.04 33.66,28.26 32.71,29.2 v32.71,29.22 | v45.09,35.24 v45.09,38.73
N$1
  Top 0.305: IC8.8 30.48,15.24 30.8,14.92 31.75,14.92 32.38,15.56 R127.1
N$2
  Top 0.305: IC12.10 46.35,10.16 46.99,9.53 48.88,9.53 51.74,6.67 R136.2 53.97,4.76 R137.1 C30.1
N$3  (via drill 0.35)
  Top 0.305: C30.2 R137.2 52.71,8.56 D9.A 50.16,8.89 48.9,10.16 IC12.8 48.9,12.7 48.28,13.31 v48.26,13.29 | v38.42,13.92 31.15,13.92 30.47,14.61 29.53,14.61 29.21,14.92 IC8.7
  Bottom 0.305: v48.26,13.29 47.62,13.92 v38.42,13.92
N$4
  Top 0.305: IC3.6 12.06,90.17 | 12.06,90.17 R2.2 R115.2 R1.2 | R3.1 11.74,90.17 12.06,90.17
N$5
  Top 0.305: T2.E 19.36,85.41 19.68,85.09 19.68,81.92 19.37,81.6 T3.E 16.68,79.69 12.7,79.69 12.06,79.06 R5.2
N$6
  Top 0.305: R3.2 10.79,89.22 IC3.7 10.79,86.04 11.75,85.09 14.61,85.09 16.83,87.31 T2.B
N$7
  Top 0.305: C1.1 9.53,78.74 10.79,80.01 IC3.2 10.79,83.68 11.75,84.63 14.79,84.63 16.52,86.36 T2.C 25.4,86.36 28.57,89.53 R4.1
N$8
  Top 0.305: IC3.1 9.53,80.64 8.26,79.38 8.26,77.47 9.21,76.52 C1.2 R5.1
N$9
  Top 0.305: T3.C 20.79,83.16 T1.B
N$10
  Top 0.305: R13.2 32.07,76.52 34.29,78.74 D2.C
N$11
  Top 0.305: T1.E 23.03,82.72 20.95,80.64 18.73,80.64 16.51,78.42 R6.2
N$12
  Top 0.305: R139.2 R138.1 61.91,5.39 59.56,3.04 49.66,3.04 47.62,5.07 IC12.6
N$13
  Top 0.305: IC12.13 42.55,14.29 43.81,15.56 C16.1 R121.1 R117.2 R140.2 R118.2
N$14
  Top 0.305: R12.2 28.57,75.56 28.89,75.25 32.07,75.25 33.34,76.52 D1.A
N$15
  Top 0.305: IC4.12 24.13,73.66 26.04,75.56 R9.1
N$17  (via drill 0.35)
  Top 0.305: C2.2 C11.2 40.63,81.92 42.67,83.96 46.49,83.96 48.26,85.72 IC1.14 48.26,88.57 v48.58,88.89 | C10.2 46.04,81.92 47.94,80.01 48.9,80.01 49.53,79.38 R10.1 | IC2.12 80.64,86.04 80.01,85.41 69.53,85.41 68.58,84.45 61.74,84.45 Q5.2 57.47,88.73 57.47,93.03 56.83,93.66 54.94,93.66 54.16,92.89 R18.1 51.76,92.07 v49.85,90.16
  Bottom 0.305: C11.2 C10.2 | v48.58,88.89 v49.85,90.16
N$18
  Top 0.305: C3.1 R11.1 48.89,76.52 R10.2 50.48,76.52 50.8,76.83 IC1.3
N$19
  Top 0.305: R128.1 69.53,78.42 | 69.53,78.42 R129.2 71.12,78.74 75.89,83.5 80.01,83.5 80.64,82.87 IC2.3 | IC4.10 26.67,73.66 27.62,74.61 33.01,74.61 33.69,75.3 47.26,75.3 47.77,74.79 68.76,74.79 69.53,75.56 69.53,78.42
N$20  (via drill 0.35)
  Top 0.305: R12.1 28.57,79.38 27.3,80.64 23.18,80.64 v18.26,75.73
  Bottom 0.305: v18.26,75.73 17.14,74.61 6.67,74.61 R15.3
N$21  (via drill 0.35)
  Top 0.305: v18.41,76.84 18.72,77.15 19.04,77.15 22.99,81.1 27.49,81.1 28.9,79.69 30.8,79.69 31.11,79.38 R13.1
  Bottom 0.305: R15.1 11.29,74.16 17.65,74.16 18.95,75.45 18.95,76.3 v18.41,76.84
N$22  (via drill 0.35)
  Top 0.305: R14.2 22.55,78.42 22.54,78.42 21.59,77.47 21.59,74.93 | 21.59,74.93 IC4.14 | v19.38,74.92 19.39,74.93 21.59,74.93
  Bottom 0.305: R15.2 10.16,71.12 12.74,73.7 17.84,73.7 19.06,74.92 v19.38,74.92
N$23
  Top 0.305: R17.1 58.41,76.52 56.67,78.26 R16.2 54.61,80.33 IC1.6
N$24
  Top 0.305: IC1.7 55.88,80.64 56.83,79.69 58.42,79.69 59.05,79.06 R17.2 60.95,76.52 R20.1
N$25
  Top 0.305: R19.1 | IC1.9 54.61,88.9 R18.2 53.98,90.17 R19.1
N$26  (via drill 0.35)
  Top 0.305: Q4.2 63.01,88.59 v60.65,88.59 | R19.2 v55.88,88.9 IC1.8
  Bottom 0.305: v55.88,88.9 60.34,88.9 v60.65,88.59
N$27
  Top 0.305: R21.2 65.41,80.64 66.99,82.23 Q4.3
N$28
  Top 0.305: R20.2 Q5.3
N$29
  Top 0.305: Q4.1 R23.1
N$30
  Top 0.305: R27.2 59.05,89.22 62.55,85.73 Q5.1
N$31
  Top 0.305: R27.1 60.95,90.17 R28.1 R26.2
N$32
  Top 0.305: R23.2 R25.2 71.12,92.07 R24.1
N$33
  Top 0.305: R25.1 72.08,88.58 75.56,88.58 78.42,91.44 R22.1 81.28,91.44 82.23,90.49 R29.1 83.82,89.53 83.19,88.9 IC2.10
N$34
  Top 0.305: R26.1 65.41,93.34 76.2,93.34 R22.2 R22.3
N$36
  Top 0.305: R41.1 12.06,48.58 R134.2 | IC7.2 R134.2 | R134.2 R39.2 R40.2
N$37
  Top 0.305: IC2.9 84.45,88.58 R31.1 88.26,92.39 R30.2
N$38  (via drill 0.35)
  Top 0.305: R30.1 88.9,89.53 88.27,88.9 86.36,88.9 85.72,88.27 IC2.8 85.72,85.41 86.68,84.45 v86.68,81.01 | R32.1 91.17,83.19 v87.63,79.64 R33.1
  Bottom 0.305: v87.63,79.64 86.68,80.6 v86.68,81.01
N$39
  Top 0.305: IC2.7 85.72,80.33 | R34.2 85.09,79.69 85.72,80.33 | 85.72,80.33 87.62,80.33 91.12,83.83 91.12,85.09 91.76,85.72 R35.1
N$40
  Top 0.305: R33.2 R34.1 84.14,76.52 83.82,76.83 83.82,80.01 84.45,80.64 IC2.6
N$41  (via drill 0.35)
  Top 0.305: IC2.14 78.11,88.27 78.42,88.58 79.06,88.58 | 79.06,88.58 79.38,88.27 IC2.13 | R36.1 92.35,88.22 v87,88.22 | v82.23,89.53 80.01,89.53 79.06,88.58
  Bottom 0.305: v87,88.22 85.68,89.53 v82.23,89.53
N$42
  Top 0.305: IC2.1 78.11,80.64 78.42,80.33 79.06,80.33 | 79.06,80.33 79.38,80.64 IC2.2 | 79.06,80.33 79.06,79.69 83.82,74.93 89.22,74.93 R37.1
N$43
  Top 0.305: IC7.1 11.43,50.48 10.16,49.21 R41.2 6.67,48.58 5.23,50.02 T5.B
N$44
  Top 0.305: T5.C 4.13,54.76 4.13,57.78 4.45,58.1 6.99,58.1 7.94,59.05 7.94,62.85 9.08,63.99 12.06,63.99 12.7,63.36 C4.1 13.02,62.55 15.24,60.33 | IC7.6 13.97,58.42 15.24,59.69 15.24,60.33 | 15.24,60.33 R42.1
N$45
  Top 0.305: IC4.9 27.94,73.66 28.26,73.98 28.89,73.98 29.53,73.34 R38.1
N$47
  Top 0.305: R6.1 16.51,76.52 19.05,73.98 IC4.16
N$48
  Top 0.305: T6.E 8.89,55.56 8.57,55.88 | 8.57,55.88 5.71,55.88 5.23,55.39 T5.E | R43.2 9.52,62.55 8.74,61.77 8.74,56.15 8.57,55.98 8.57,55.88
N$49
  Top 0.305: IC7.7 C4.2 R43.1
N$50
  Top 0.305: T6.C 7.76,57.15 T4.B
N$53
  Top 0.305: R51.2 34.6,51.44 D4.C
N$54
  Top 0.305: R50.2 30.48,53.66 31.11,54.29 34.29,54.29 34.92,53.66 D3.A
N$55
  Top 0.305: R47.1 24.77,63.82 24.13,64.45 IC4.5
N$57  (via drill 0.35)
  Top 0.305: C5.2 C15.2 38.72,57.15 40.45,58.88 46.18,58.88 46.99,59.69 IC5.14 46.99,62.87 v47.31,63.18 | C14.2 43.5,57.15 R48.1 | v48.58,64.45 50.48,66.36 R56.1 53.34,67.63 55.56,67.63 56.2,66.99 56.2,63.65 59.38,60.47 Q2.2 59.38,60.01 60.33,59.05 67.63,59.05 67.94,59.37 80.33,59.37 80.64,59.69 IC6.12
  Bottom 0.305: C15.2 C14.2 | v47.31,63.18 v48.58,64.45
N$58
  Top 0.305: R49.1 45.4,52.7 C6.1 47.62,50.48 R48.2 48.9,50.48 49.53,51.12 IC5.3
N$59  (via drill 0.35)
  Top 0.305: R130.1 68.26,52.38 | 68.26,52.38 R131.2 69.85,53.66 73.66,57.47 80.33,57.47 80.64,57.15 IC6.3 | v27.62,49.53 27.62,54.32 30.16,56.86 30.16,61.59 26.67,65.09 IC4.7 | v33.97,49.53 44.13,49.53 44.91,48.76 67.49,48.76 68.26,49.53 68.26,52.38
  Bottom 0.305: v27.62,49.53 v33.97,49.53
N$60
  Top 0.305: R50.1 30.48,49.53 27.3,46.35 R53.3
N$61
  Top 0.305: R51.1 33.02,49.53 29.84,46.35 R53.1
N$62  (via drill 0.35)
  Top 0.305: IC4.3 R52.2 22.54,62.55 23.18,61.91 23.18,59.69 26.71,56.16 26.71,48.58 v26.67,48.58
  Bottom 0.305: R53.2 v26.67,48.58
N$63
  Top 0.305: IC5.6 53.34,54.29 R54.2 55.88,52.38 R55.1
N$64
  Top 0.305: IC5.7 54.61,54.61 55.56,53.66 57.15,53.66 57.78,53.02 R55.2 58.42,52.38 R58.1
N$65
  Top 0.305: IC5.9 53.34,62.55 52.07,63.82 R56.2 52.71,64.45 R57.1
N$66  (via drill 0.35)
  Top 0.305: IC5.8 v54.61,62.87 R57.2 | v60.01,62.87 62.06,62.87 Q1.2
  Bottom 0.305: v54.61,62.87 v60.01,62.87
N$67
  Top 0.305: R59.2 64.14,54.29 65.72,55.88 Q1.3
N$68
  Top 0.305: R58.2 Q2.3
N$69
  Top 0.305: R61.1 Q1.1
N$70
  Top 0.305: R65.2 57.78,63.82 61.27,60.33 Q2.1
N$71
  Top 0.305: R65.1 59.69,64.45 R66.1 R64.2
N$72
  Top 0.305: R61.2 R63.2 71.11,64.45 R62.1
N$73
  Top 0.305: R63.1 69.22,63.82 70.17,62.87 72.71,62.87 80.33,70.48 82.23,70.48 | IC6.10 83.19,62.55 83.82,63.18 R67.1 82.86,64.45 82.23,65.09 82.23,70.48 | 82.23,70.48 R60.1
N$74
  Top 0.305: R64.1 62.87,66.99 65.09,69.22 78.41,69.22 80.14,70.94 86.5,70.94 88.58,73.03 R60.2 R60.3
N$75
  Top 0.305: IC6.9 84.45,62.55 R69.1 87,64.45 R68.2
N$76  (via drill 0.35)
  Top 0.305: R68.1 88.9,63.5 88.58,63.18 86.68,63.18 85.72,62.23 IC6.8 85.72,59.37 86.68,58.42 v86.68,54.98 | R108.1 R71.1 v87.63,53.61
  Bottom 0.305: v87.63,53.61 86.68,54.56 v86.68,54.98
N$77
  Top 0.305: IC6.7 85.72,54.29 | 85.72,54.29 85.09,53.66 R72.2 | 85.72,54.29 88.57,54.29 90.81,56.52 90.81,58.42 92.08,59.69 R111.1
N$78
  Top 0.305: IC6.6 84.45,54.61 83.82,53.98 83.82,50.8 84.14,50.48 R72.1 R71.2
N$79  (via drill 0.35)
  Top 0.305: IC6.14 78.11,61.91 78.74,62.55 | 78.74,62.55 79.38,61.91 IC6.13 | v82.23,62.87 79.06,62.87 78.74,62.55 | v87.31,62.23 R112.1
  Bottom 0.305: v82.23,62.87 86.68,62.87 v87.31,62.23
N$80
  Top 0.305: IC6.1 78.11,54.93 78.74,54.29 | 78.74,54.29 79.38,54.93 IC6.2 | R113.1 89.54,49.21 83.82,49.21 78.74,54.29
N$82
  Top 0.305: R118.1 R119.2 R120.2
N$83
  Top 0.305: IC4.8 27.94,66.04 28.26,65.72 28.57,65.72 29.21,66.36 R76.1
N$85
  Top 0.305: T4.E 6.65,59.05 7.3,59.7 7.3,63.18 8.89,64.77 16.51,64.77 17.78,63.5 R44.2
N$86
  Top 0.305: IC4.1 19.05,61.28 18.41,60.64 R44.1
N$91
  Top 0.305: IC11.6 R135.2 | R135.2 R78.2 R77.2 | R79.1 12.06,39.05 R135.2
N$92
  Top 0.305: R79.2 10.16,38.1 11.43,36.83 IC11.7 11.43,34.61 12.38,33.66 14.29,33.66 16.51,35.88 T8.B
N$93
  Top 0.305: C7.1 10.16,27.94 11.43,29.21 IC11.2 11.43,32.24 12.38,33.2 14.48,33.2 16.2,34.92 T8.C 20.95,35.09 20.95,37.15 20.32,37.78 R80.1
N$94
  Top 0.305: R81.2 12.7,27.62 13.34,28.26 16.68,28.26 T9.E 19.68,31.27 19.68,33.02 18.73,33.98 T8.E
N$95
  Top 0.305: IC11.1 10.16,29.21 8.89,27.94 8.89,25.72 9.52,25.09 C7.2 R81.1
N$96
  Top 0.305: T9.C 20.79,32.85 21.91,33.97 T7.B
N$99
  Top 0.305: D6.C 32.71,25.72 R89.2
N$100
  Top 0.305: D5.A 33.66,24.45 30.16,24.45 29.84,24.77 R88.2
N$101
  Top 0.305: IC8.12 26.67,23.81 27.3,24.45 R85.1
N$103  (via drill 0.35)
  Top 0.305: C8.2 C13.2 39.99,31.11 41.42,32.54 46.19,32.54 46.99,33.34 IC9.14 46.99,37.13 v47.58,37.72 | C12.2 44.13,31.11 R86.1 | v48.9,39.05 50.81,40.95 R94.1 53.34,42.23 55.56,42.23 56.2,41.59 56.2,37.3 Q6.2 60.48,33.02 67.94,33.02 70.17,35.24 80.33,35.24 80.64,35.56 IC10.12
  Bottom 0.305: C13.2 C12.2 | v47.58,37.72 v48.9,39.05
N$104
  Top 0.305: IC9.3 49.53,25.4 49.21,25.08 R86.2 46.36,26.98 C9.1 R87.1
N$105
  Top 0.305: R132.1 68.9,26.98 | 68.9,26.98 R133.2 70.48,29.21 74.61,33.34 80.01,33.34 80.64,32.7 IC10.3 | IC8.10 29.21,22.86 30.16,23.81 45.09,23.81 45.72,23.18 67.94,23.18 68.9,24.13 68.9,26.98
N$106  (via drill 0.35)
  Top 0.305: R88.1 29.84,28.57 28.57,29.84 24.77,29.84 v20.64,25.72
  Bottom 0.305: v20.64,25.72 18.1,23.18 6.99,23.18 5.71,21.91 R91.3
N$107  (via drill 0.35)
  Top 0.305: v20.63,26.68 20.95,26.68 24.58,30.3 28.76,30.3 29.86,29.21 31.75,29.21 32.38,28.57 R89.1
  Bottom 0.305: R91.1 11.93,22.72 18.29,22.72 20.33,24.77 20.95,24.77 21.59,25.4 21.59,26.04 20.95,26.68 v20.63,26.68
N$108  (via drill 0.35)
  Top 0.305: IC8.14 24.13,23.81 22.86,25.08 v22.86,25.4 22.86,26.67 23.81,27.62 R90.2
  Bottom 0.305: R91.2 9.84,19.05 13.06,22.26 18.48,22.26 20.52,24.31 21.14,24.31 22.24,25.4 v22.86,25.4
N$109
  Top 0.305: IC9.6 53.34,28.89 R92.2 55.56,26.98 57.46,25.09 R93.1
N$110
  Top 0.305: IC9.7 54.61,29.21 55.56,28.26 57.47,28.26 57.78,27.94 R93.2 58.11,26.98 60.01,25.09 R96.1
N$111
  Top 0.305: IC9.9 53.34,36.83 52.07,38.1 R94.2 53.97,40.95 R95.1
N$112  (via drill 0.35)
  Top 0.305: R95.2 v54.61,37.47 IC9.8 | v59.05,37.47 61.74,37.47 Q3.2
  Bottom 0.305: v54.61,37.47 v59.05,37.47
N$113
  Top 0.305: Q3.3 66.04,30.48 64.77,29.21 R97.2
N$114
  Top 0.305: R96.2 Q6.3
N$115
  Top 0.305: Q3.1 66.99,35.88 66.67,36.2 R99.1
N$116
  Top 0.305: R103.2 57.78,37.61 Q6.1
N$117
  Top 0.305: R103.1 58.1,40.95 60.01,39.05 R104.1 R102.2
N$118
  Top 0.305: R99.2 R101.2 69.53,40.95 71.43,39.05 R100.1
N$119
  Top 0.305: R101.1 69.22,38.42 69.85,37.78 72.39,37.78 77.97,43.36 81.15,43.36 | 81.15,43.36 83.37,45.58 87.14,45.58 R98.1 | IC10.10 83.19,38.1 83.82,38.73 R105.1 83.19,40.32 82.55,40.96 82.55,41.96 81.15,43.36
N$120
  Top 0.305: R102.1 62.87,41.59 65.09,43.81 80.96,43.81 83.19,46.04 87.31,46.04 88.9,47.62 R98.2 R98.3
N$121
  Top 0.305: IC10.9 84.45,38.42 R107.1 86.68,40.33 88.58,42.23 R106.2
N$122  (via drill 0.35)
  Top 0.305: R106.1 88.9,39.69 88.27,39.05 86.36,39.05 85.72,38.42 IC10.8 85.72,35.24 86.68,34.29 v86.68,31.11 | R109.1 v87.63,29.48 88.87,29.48 90.5,31.11 R70.1
  Bottom 0.305: v87.63,29.48 86.68,30.43 v86.68,31.11
N$123
  Top 0.305: IC10.7 85.72,30.16 | 85.72,30.16 85.09,29.53 R110.2 | R73.1 88.58,30.16 85.72,30.16
N$124
  Top 0.305: IC10.6 84.45,29.84 83.5,28.89 83.5,26.99 84.14,26.36 R110.1 R109.2
N$125  (via drill 0.35)
  Top 0.305: IC10.14 78.11,37.78 78.74,38.42 | 78.74,38.42 79.38,37.78 IC10.13 | 78.74,38.42 79.06,38.73 v82.55,38.73 | v87,38.1 88.9,36.2 R74.1
  Bottom 0.305: v82.55,38.73 86.36,38.73 v87,38.1
N$126
  Top 0.305: IC10.1 78.11,30.8 78.74,30.16 | 78.74,30.16 79.38,30.8 IC10.2 | 78.74,30.16 83.82,25.08 89.53,25.08 90.49,26.04 R75.1
N$127
  Top 0.305: IC8.9 30.48,22.86 30.8,23.18 31.43,23.18 32.07,22.54 R114.1
N$129
  Top 0.305: R82.2 16.19,26.98 18.1,28.89 20.64,28.89 23.03,31.29 T7.E
N$130
  Top 0.305: R82.1 20.32,25.09 21.59,23.81 IC8.16
N$133
  Top 0.305: C16.2 42.86,18.09 42.23,17.46 42.23,15.24 40.48,13.49 | R116.1 37.15,10.16 40.48,13.49 | 40.48,13.49 41.27,12.7 IC12.14
N$134
  Top 0.305: R116.2 34.61,7.3 T10.B
N$135
  Top 0.305: R121.2 46.35,18.73 45.4,19.68 43.18,19.68 41.77,18.27 41.77,15.43 35.55,9.21 T10.E
N$136
  Top 0.305: IC8.1 21.59,9.21 22.54,8.26 T10.C
N$137
  Top 0.305: IC8.3 R124.2
N$138  (via drill 0.35)
  Top 0.305: R138.2 63.81,5.39 61.91,3.5 R126.2 60.96,2.22 v51.44,2.22 51.12,1.91 35.56,1.91 35.24,2.22 35.24,4.45 35.88,5.08 C17.2 R125.2 40,4.13 40.64,4.13 41.27,4.76 IC12.1 | v50.16,4.45 50.48,4.76 R136.1
  Bottom 0.305: v51.44,2.22 50.16,3.49 v50.16,4.45
N$139
  Top 0.305: IC8.4 25.4,14.92 26.67,13.65 R123.2 R122.2
N$142  (via drill 0.35)
  Top 0.305: IC8.5 26.67,15.24 27.9,14.01 30.12,14.01 31.43,12.7 v36.2,12.7 | v39.37,9.53 40.64,8.26 43.18,8.26 43.81,7.62 IC12.3 43.81,3.81 43.18,3.18 R125.1 C17.1
  Bottom 0.305: v39.37,9.53 39.35,9.53 36.2,12.69 v36.2,12.7
N$143
  Top 0.305: IC9.1 46.99,31.43 46.34,32.08 41.6,32.08 38.73,29.2 D6.A D5.C 40.64,25.72 41.27,25.09 R87.2 C9.2 45.72,24.13 46.04,23.81 53.98,23.81 R92.1 56.52,23.81 63.5,23.81 R97.1 R132.2
N$144
  Top 0.305: IC5.1 46.99,57.15 45.72,58.42 40.64,58.42 39.68,57.46 D3.C D4.A 41.28,51.44 41.91,50.8 R49.2 45.4,50.8 C6.2 46.99,49.21 53.97,49.21 R54.1 56.52,49.21 62.86,49.21 R59.1 R130.2
N$145
  Top 0.305: R128.2 R21.1 64.14,76.52 62.87,75.25 56.83,75.25 56.52,75.56 R16.1 52.07,76.52 50.8,75.25 48.26,75.25 R11.2 C3.2 D1.C D2.A 39.37,80 42.86,83.5 47.94,83.5 48.26,83.19 IC1.1
N$146
  Top 0.508: SV1.10 SV1.9 D7.A
N$147
  Top 0.508: SV1.2 SV1.1 D8.C
RATE1
  Top 0.305: R1.1 20.95,93.82 22.23,95.09 30.63,95.09 32.2,93.52 36.17,93.52 JP2.3
RATE2
  Top 0.305: JP4.2 38.65,68.81 31.11,61.28 31.11,56.52 28.89,54.29 28.89,48.9 27.3,47.31 21.27,47.31 18.73,44.77 16.19,44.77 15.24,45.72 R39.1
RATE3
  Top 0.305: R77.1 17.78,42.09 18.41,42.72 22.35,42.72 22.99,42.09 35.74,42.09 JP6.2
RATEH1
  Top 0.305: R8.1 26.04,93.52 26.67,94.16 30.27,94.16 31.82,92.61 40.34,92.61 JP2.5
RATEH2
  Top 0.305: R46.1 43.73,72.16 JP4.4
RATEH3
  Top 0.305: JP6.4 43.73,47.71 R84.1
RATEL1
  Top 0.305: R7.2 23.5,93.98 24.13,94.61 30.46,94.61 32.01,93.07 38.26,93.07 JP2.4
RATEL2
  Top 0.305: R45.2 42.23,69.97 JP4.3
RATEL3
  Top 0.305: JP6.3 41.19,42.31 R83.2
RMP1
  Top 0.305: R35.2 JP3.5
RMP2
  Top 0.305: R111.2 97.96,59.69 JP5.5
RMP3
  Top 0.305: R73.2 97.92,33.66 JP7.5
RNGCOM1  (via drill 0.35)
  Top 0.305: R9.2 v26.04,79.69 | v28.89,80.96 C2.1 36.2,85.72 44.45,85.72 48.74,90.01 | 48.74,90.01 52.07,93.34 53.66,93.34 56.31,96 JP2.10 | IC1.13 49.53,89.22 48.74,90.01
  Bottom 0.305: v26.04,79.69 27.62,79.69 v28.89,80.96
RNGCOM2  (via drill 0.35)
  Top 0.305: C5.1 34.92,60.96 43.85,60.96 47.33,64.44 | 47.33,64.44 JP4.8 | IC5.13 48.26,63.5 47.33,64.44 | R47.2 v29.21,60.65 v29.21,60.64
  Bottom 0.305: C5.1 32.07,60.64 v29.21,60.64
RNGCOM3  (via drill 0.35)
  Top 0.305: R85.2 v27.3,28.89 | v29.84,30.48 29.84,31.75 C8.1 35.56,34.92 43.81,34.92 47.78,38.89 | JP6.8 47.78,38.89 | IC9.13 48.26,38.42 47.78,38.89
  Bottom 0.305: v27.3,28.89 28.26,28.89 v29.84,30.48
RNGL1
  Top 0.305: C11.1 39.7,87.96 45.39,87.96 51.35,93.92 JP2.8
RNGL2
  Top 0.305: C15.1 38.73,63.5 45.1,63.5 48.81,67.21 JP4.6
RNGL3
  Top 0.305: C13.1 39.06,37.16 42.95,37.16 42.96,37.15 44.74,37.15 48.81,41.21 JP6.6
RNGM1
  Top 0.305: JP2.9 53.89,95.81 45.07,87 C10.1
RNGM2
  Top 0.305: C14.1 44.47,62.23 51.35,69.11 JP4.7
RNGM3
  Top 0.305: C12.1 44.44,36.2 51.35,43.11 JP6.7
SAW1
  Top 0.305: R32.2 JP3.6
SAW2
  Top 0.305: R108.2 97.96,57.15 JP5.6
SAW3
  Top 0.305: R70.2 97.92,31.11 JP7.6
SQR1
  Top 0.305: R37.2 JP3.8
SQR2
  Top 0.305: R113.2 97.96,52.07 JP5.8
SQR3
  Top 0.305: R75.2 97.92,26.04 JP7.8
TRI1  (via drill 0.35)
  Top 0.305: R36.2 v95.57,88.27 JP3.4 | v94.3,19.32 52.02,19.32 51.44,18.73 R140.1
  Bottom 0.305: v95.57,88.27 95.57,63.5 94.61,62.55 94.61,61.91 95.57,60.96 95.57,37.78 94.3,36.51 94.3,35.56 94.79,35.06 94.79,21.77 94.3,21.27 v94.3,19.32
TRI2  (via drill 0.35)
  Top 0.305: R112.2 v95.57,62.23 97.96,62.23 JP5.4 | R117.1 48.9,18.73 50.16,20 96,20 96.25,20.25 v96.25,21.77
  Bottom 0.305: v96.25,21.77 95.71,22.31 95.71,35.69 96.17,36.15 96.17,61.63 v95.57,62.23
TRI3  (via drill 0.35)
  Top 0.305: R74.2 v95.25,36.2 97.92,36.2 JP7.4 | R122.1 29.53,10.48 30.8,11.75 37.44,11.75 41.27,15.58 41.27,18.41 41.31,18.45 41.31,18.46 43.31,20.46 94.58,20.46 v95.25,21.13
  Bottom 0.305: v95.25,36.2 v95.25,21.13

### Text on the board
tPlace: SLOPE 1 | ALL | LFO1 | SLOPE 1 | SLOPE 2 | SLOPE 3 | TRI SYM 2 | I hope this chunk of electronics / aids you in your creative endeavors | TRI SYM 3 | Seismograph Prototype / Tom Evans / Nov 2020 / CC BY SA 4.0